# EAGLE design WFT0420CZ15_conv (EAGLE 7.5.0)
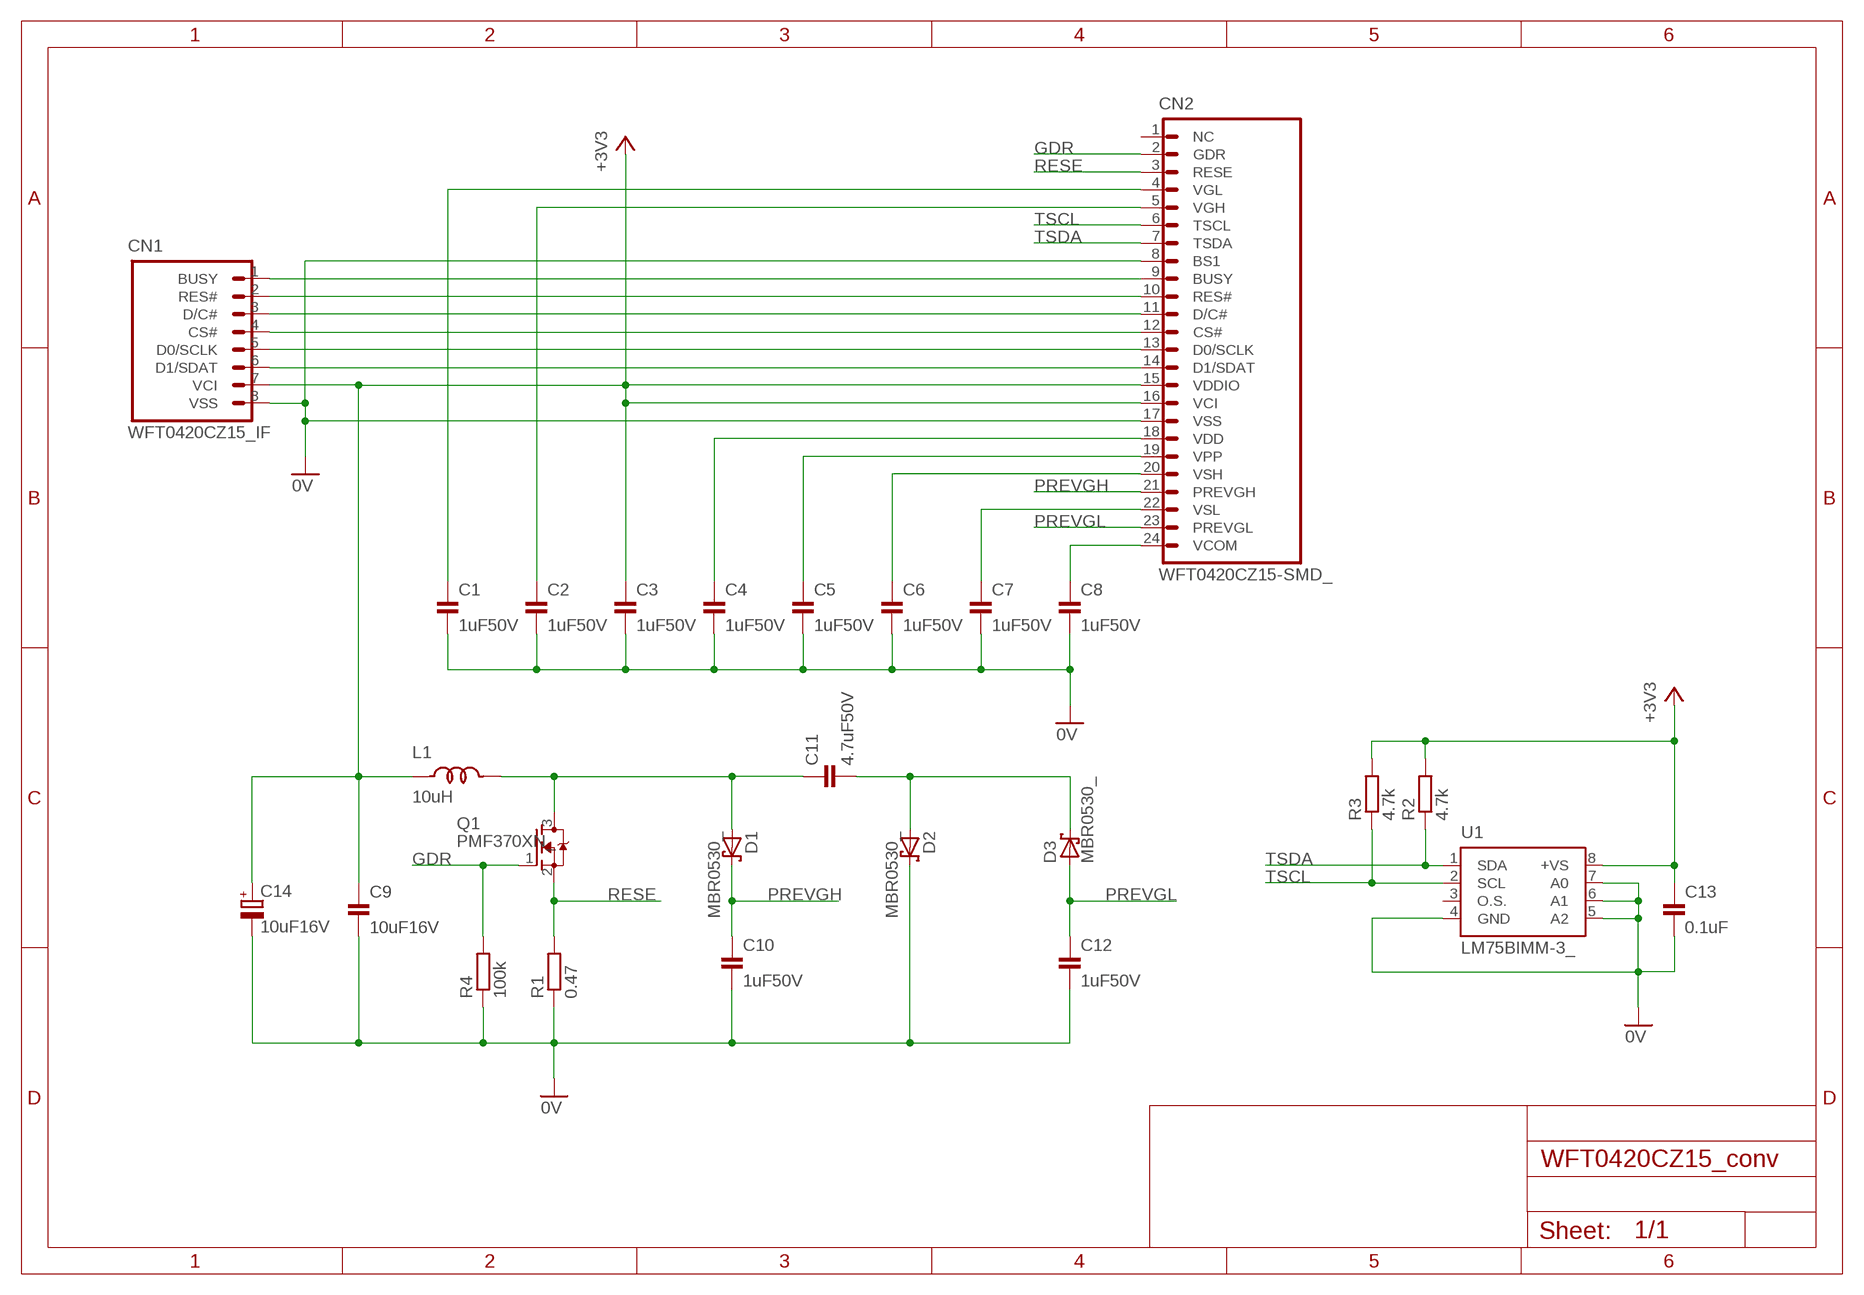
[diagram p0: schematic, sheet 1]

## Parts
C1  1uF50V  CAP_0805  [SMD_2012]
C2  1uF50V  CAP_0805  [SMD_2012]
C3  1uF50V  CAP_0805  [SMD_2012]
C4  1uF50V  CAP_0805  [SMD_2012]
C5  1uF50V  CAP_0805  [SMD_2012]
C6  1uF50V  CAP_0805  [SMD_2012]
C7  1uF50V  CAP_0805  [SMD_2012]
C8  1uF50V  CAP_0805  [SMD_2012]
C9  10uF16V  CAP_0805  [SMD_2012]
C10  1uF50V  CAP_0805  [SMD_2012]
C11  4.7uF50V  CAP_0805  [SMD_2012]
C12  1uF50V  CAP_0805  [SMD_2012]
C13  0.1uF  CAP_0805  [SMD_2012]
C14  10uF16V  TPST106K016R0800  [C1210_TPST]
CN1  WFT0420CZ15_IF  [WFT0420CZ15_IF_8PIN]
CN2  WFT0420CZ15-SMD_  [FH12A-24S-0.5SH_DEV]
D1  MBR0530_  [MBR0530_DEV]
D2  MBR0530_  [MBR0530_DEV]
D3  MBR0530_  [MBR0530_DEV]
L1  10uH  NLCV25T  [NLCV25T]
Q1  PMF370XN_  [SOT323_DEV]
R1  0.47  RESISTOR_0805  [SMD_2012]
R2  4.7k  RESISTOR_0805  [SMD_2012]
R3  4.7k  RESISTOR_0805  [SMD_2012]
R4  100k  RESISTOR_0805  [SMD_2012]
U1  LM75BIMM-3_  [SSOP8-DGK_DEV]

## Nets
0V: C1.2 C2.2 C3.2 C4.2 C5.2 C6.2 C7.2 C8.2 C9.2 C10.2 C12.2 C13.2 C14.2(-) CN1.8(VSS) CN2.8(BS1) CN2.17(VSS) D2.1(C) R1.1 R4.1 U1.4(GND) U1.5(A2) U1.6(A1) U1.7(A0)
+3V3: C3.1 C9.1 C13.1 C14.1(+) CN1.7(VCI) CN2.15(VDDIO) CN2.16(VCI) L1.1 R2.2 R3.2 U1.8(+VS)
GDR: CN2.2(GDR) Q1.1(G) R4.2
N$1: C8.1 CN2.24(VCOM)
N$2: C7.1 CN2.22(VSL)
N$3: C6.1 CN2.20(VSH)
N$4: C5.1 CN2.19(VPP)
N$5: C4.1 CN2.18(VDD)
N$6: C11.1 D1.2(A) L1.2 Q1.3(D)
N$7: C2.1 CN2.5(VGH)
N$8: C1.1 CN2.4(VGL)
N$9: CN1.1(BUSY) CN2.9(BUSY)
N$10: CN1.2(RES#) CN2.10(RES#)
N$11: CN1.3(D/C#) CN2.11(D/C#)
N$12: CN1.4(CS#) CN2.12(CS#)
N$13: CN1.5(D0/SCLK) CN2.13(D0/SCLK)
N$14: CN1.6(D1/SDAT) CN2.14(D1/SDAT)
N$15: C11.2 D2.2(A) D3.1(C)
PREVGH: C10.1 CN2.21(PREVGH) D1.1(C)
PREVGL: C12.1 CN2.23(PREVGL) D3.2(A)
RESE: CN2.3(RESE) Q1.2(S) R1.2
TSCL: CN2.6(TSCL) R3.1 U1.2(SCL)
TSDA: CN2.7(TSDA) R2.1 U1.1(SDA)
Unconnected: CN2.1(NC) U1.3(O.S.)

## Library data of the parts
C1-C13 = Parts:CAP: コンデンサー
C14 = Parts:TPST*: タンタルコンデンサ TPST106K016R0800 10µF ±10% 16V ESR（等価直列抵抗）: 0.8オーム 動作温度 : -55°C～125°C サイズ : 3.50mm x 2.80mm
CN1 = PartsForProto:WFT0420CZ15_IF: WF0420CZ15変換基板用I/F
CN2 = PartsForProto:WFT0420CZ15: インターフェースピン
D1-D3 = Parts:MBR0530: ショットキーダイオード
L1 = Parts:NLCV*: LEAD INDUCTOR
Q1 = Parts:PMF370XN: N-Channel 30 V (D-S) MOSFET
R1-R4 = Parts:RESISTOR: 抵抗器
U1 = Parts:LM75B*: 基板取付型温度センサー

## Board
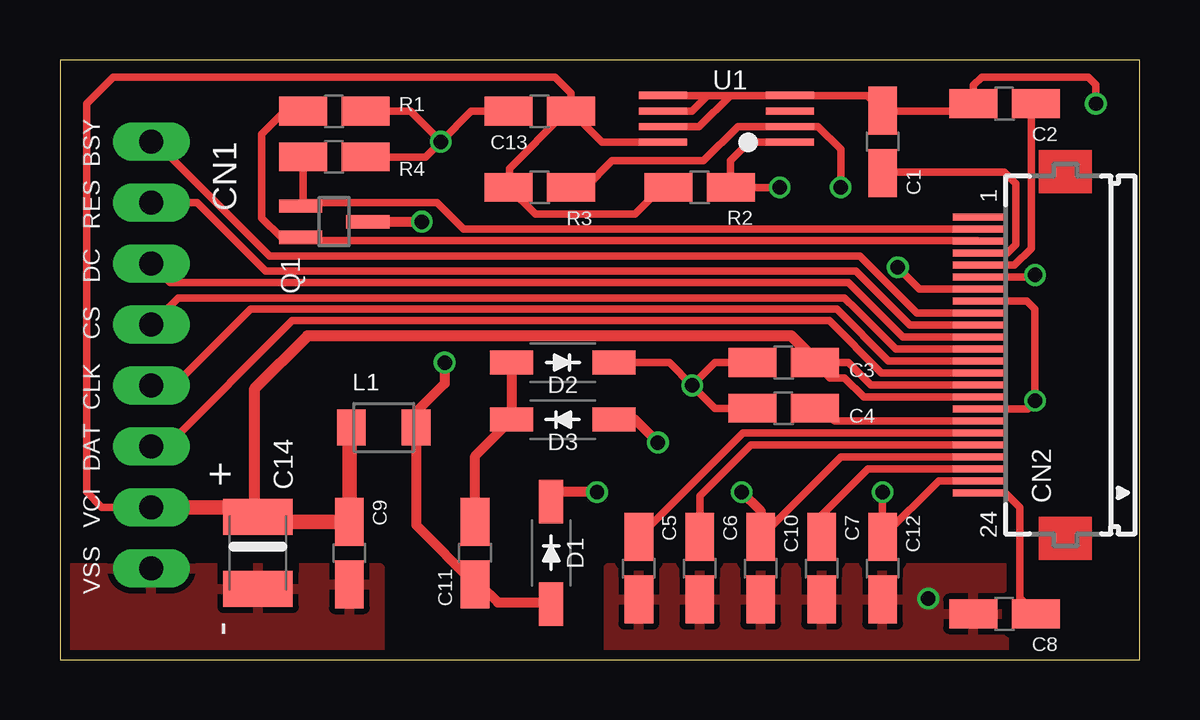
[diagram p1: board, top side]
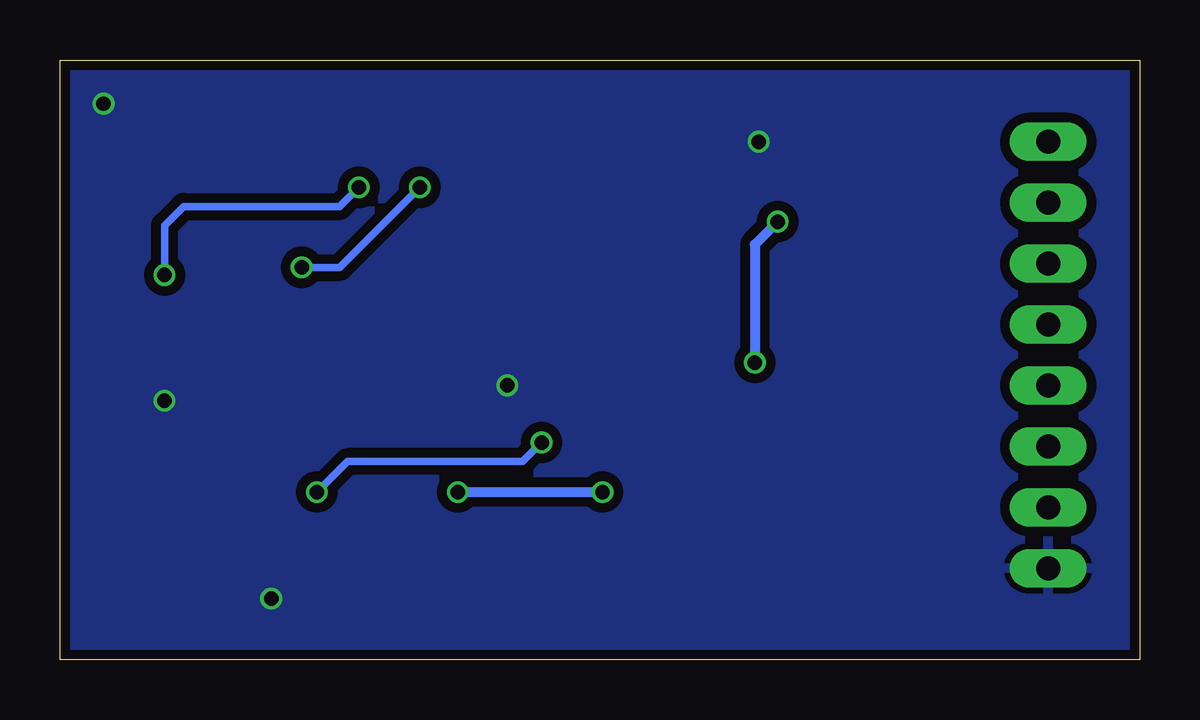
[diagram p2: board, bottom side, seen from below]

Size 45 x 25 mm. Coordinates in mm from the lower left corner, seen from the top.
Outline: 0,0 45,0 45,25 0,25 0,0
Copper layers (1*16): Top 0.035mm / dielectric 1.5mm / Bottom 0.035mm
Design rules "SeeedStudio_2layer_DRU_no_angle_20140221": minimum track width 6mil, minimum drill 12mil, track to track 6mil, track to pad 6mil, pad to pad 6mil, via to via 6mil, smd to smd 0mil, copper to edge 10mil, drill to drill 10mil, minimum pad ring 10mil, minimum via ring 6mil, stop-mask expansion 2mil, vias tented up to drill 100mil, thermal gap 10mil

### Footprints (pad centres in the part's own frame; a part is rotated, then mirrored left to right if it is on the bottom)
SMD_2012 = smd 2 x 1.2: 1 -1.3,0; 2 1.3,0
C1210_TPST = smd 1.5 x 2.9: 1 -1.5,0; 2 1.5,0
WFT0420CZ15_IF_8PIN = drill 1 pad 1.6 long: 1 0,0; 2 2.54,0; 3 5.08,0; 4 7.62,0; 5 10.16,0; 6 12.7,0; 7 15.24,0; 8 17.78,0
FH12A-24S-0.5SH_DEV = smd 0.3 x 2.1: 1 5.75,3.65; 2 5.25,3.65; 3 4.75,3.65; 4 4.25,3.65; 5 3.75,3.65; 6 3.25,3.65; 7 2.75,3.65; 8 2.25,3.65; 9 1.75,3.65; 10 1.25,3.65; 11 0.75,3.65; 12 0.25,3.65; 13 -0.25,3.65; 14 -0.75,3.65; 15 -1.25,3.65; 16 -1.75,3.65; 17 -2.25,3.65; 18 -2.75,3.65; 19 -3.25,3.65; 20 -3.75,3.65; 21 -4.25,3.65; 22 -4.75,3.65; 23 -5.25,3.65; 24 -5.75,3.65
MBR0530_DEV = smd 1.8 x 1: 1 -2.135,0; 2 2.135,0
NLCV25T = smd 1.2 x 1.5: 1 -1.35,0; 2 1.35,0
SOT323_DEV = smd 0.56 x 1.8: 1 -0.65,-1.4; 2 0.65,-1.4; 3 0,1.4
SSOP8-DGK_DEV = smd 0.3 x 2: 1 -0.975,-2.65; 2 -0.325,-2.65; 3 0.325,-2.65; 4 0.975,-2.65; 5 0.975,2.65; 6 0.325,2.65; 7 -0.325,2.65; 8 -0.975,2.65

### Placement (x,y rotation side)
C1  34.29,21.59 90 top
C2  39.37,23.18 180 top
C3  30.16,12.38 180 top
C4  30.16,10.48 180 top
C5  24.13,3.81 270 top
C6  26.67,3.81 270 top
C7  31.75,3.81 270 top
C8  39.37,1.91 180 top
C9  12.06,4.45 270 top
C10  29.21,3.81 270 top
C11  17.3,4.45 90 top
C12  34.29,3.81 270 top
C13  20,22.86 180 top
C14  8.26,4.45 270 top
CN1  3.81,21.59 270 top
CN2  41.91,12.7 90 top
D1  20.48,4.45 270 top
D2  20.95,12.38 180 top
D3  20.95,10 0 top
L1  13.49,9.68 0 top
Q1  11.43,18.26 270 top
R1  11.43,22.86 180 top
R2  26.67,19.68 180 top
R3  20,19.68 180 top
R4  11.43,20.95 180 top
U1  27.78,22.54 90 top

### Tracks (layer width: path | path; a pad name or v marks a point on that pad's centre or on a via)
0V  (via drill 0.6)
  Top 0.305: CN2.17 40.35,10.45 v40.64,10.79 40.64,14.61 40.3,14.95 CN2.8 | C3.2 27.3,12.38 v26.35,11.43 | C4.2 27.3,10.48 v26.35,11.43 | D2.1 25.4,12.38 v26.35,11.43 | 13.34,22.86 R1.1 14.61,22.86 v15.88,21.59 | C13.2 17.14,22.86 v15.88,21.59 | U1.5 26.99,23.52 | 26.99,23.52 27.94,23.52 | 27.94,23.52 U1.4 33.66,23.52 C1.2 34.32,22.86 37.78,22.86 38.07,23.15 C2.2 38.07,23.94 38.42,24.29 42.86,24.29 43.18,23.97 v43.18,23.18 | U1.6 26.34,22.87 26.99,23.52 | U1.7 26.64,22.22 27.94,23.52 | R4.1 15.24,20.95 v15.88,21.59
  other vias: 36.2,2.54
  pour Bottom (isolate 0.406): -1.27,26.04 46.35,26.04 46.35,-0.79 -1.27,-0.79
  pour Top (isolate 0.406): 22.86,-0.64 39.37,-0.64 39.37,3.81 22.86,3.81
  pour Top (isolate 0.406): -0.64,-0.64 13.34,-0.64 13.34,3.81 -0.64,3.81
+3V3
  Top 0.305: CN2.16 33.5,10.95 32.7,11.75 32.1,11.75 C3.1 | C13.1 21.3,23.62 20.64,24.29 2.22,24.29 1.11,23.18 1.11,6.99 1.75,6.35 CN1.7 | 8.46,5.75 C14.1 | C14.1 7.39,5.95 6.99,6.35 | U1.8 22.59,21.57 C13.1 | C3.1 31.43,12.38 | 8.41,6.1 C14.1 | CN2.15 33.79,11.45 32.86,12.38 C3.1 | C13.1 21.3,22.73 20.98,22.73 18.73,20.48 18.73,19.71 R3.2 19.81,18.57 23.97,18.57 25.08,19.68 R2.2
  Top 0.406: 32.23,12.38 C3.1
  Top 0.457: C3.1 31.46,12.51 30.48,13.49 10.32,13.49 8.1,11.27 8.1,6.1 C14.1
  Top 0.61: 8.46,5.75 C9.1 12.06,9.61 L1.1 | 6.99,6.35 CN1.7
GDR
  Top 0.305: CN2.2 16.83,17.94 15.72,19.05 10.17,19.05 Q1.1 10.13,19.01 R4.2
N$1
  Top 0.305: CN2.24 39.41,6.95 40.01,6.35 40.01,2.57 C8.1
N$2
  Top 0.305: CN2.22 33.67,7.95 31.75,6.03 C7.1
N$3
  Top 0.305: CN2.20 28.79,8.95 26.67,6.83 C6.1
N$4
  Top 0.305: CN2.19 28.47,9.45 C5.1
N$5
  Top 0.305: CN2.18 32.31,9.95 C4.1
N$6  (via drill 0.6)
  Top 0.406: v16.03,12.38 16.03,11.51 14.84,10.32 L1.2 14.84,5.61 C11.1 17.49,3.15 18.26,2.38 20.41,2.38 D1.2 | Q1.3 v15.08,18.26
  Bottom 0.406: v16.03,12.38 16.03,17.3 v15.08,18.26
N$7
  Top 0.305: CN2.5 39.79,16.45 40.48,17.14 40.48,22.99 C2.1
N$8
  Top 0.305: CN2.4 39.49,16.95 39.85,17.3 39.85,19.84 39.37,20.32 34.32,20.32 C1.1
N$9
  Top 0.305: CN2.9 35.72,14.45 33.34,16.83 8.73,16.83 3.97,21.59 CN1.1
N$10
  Top 0.305: CN2.10 35.42,13.95 33.18,16.19 8.57,16.19 5.71,19.05 CN1.2
N$11
  Top 0.305: CN2.11 35.13,13.45 32.86,15.72 4.6,15.72 CN1.3
N$12
  Top 0.305: CN2.12 34.83,12.95 33.26,14.53 33.18,14.61 32.7,15.08 4.92,15.08 CN1.4
N$13
  Top 0.305: CN2.13 34.54,12.45 32.38,14.61 7.94,14.61 4.76,11.43 CN1.5
N$14
  Top 0.305: CN2.14 34.25,11.95 32.07,14.13 9.68,14.13 4.45,8.89 CN1.6
N$15
  Top 0.406: D2.2 D3.1 17.3,8.48 C11.2
PREVGH  (via drill 0.6)
  Top 0.305: CN2.21 32.55,8.45 C10.1
  Top 0.406: C10.1 29.21,6.19 v28.42,6.99 | v22.38,6.99 20.88,6.99 D1.1
  Bottom 0.406: v28.42,6.99 v22.38,6.99
PREVGL  (via drill 0.6)
  Top 0.305: 34.32,5.08 C12.1 | C12.1 v34.29,6.99 | CN2.23 36.63,7.45 C12.1
  Top 0.406: D3.2 23.97,10 v24.92,9.05
  Bottom 0.305: v24.92,9.05 25.72,8.26 33.02,8.26 v34.29,6.99
RESE
  Top 0.305: CN2.3 38.25,17.46 10.17,17.46 Q1.2 9.22,17.61 8.41,18.41 8.41,21.91 9.37,22.86 R1.2
TSCL  (via drill 0.6)
  Top 0.305: R3.1 21.91,19.68 23.02,20.8 26.83,20.8 28.26,22.23 U1.2 31.59,22.23 32.54,21.27 v32.54,19.68 | CN2.6 40.56,15.95 v40.64,16.03
  Bottom 0.305: v40.64,16.03 40.64,18.1 39.85,18.89 33.34,18.89 v32.54,19.68
TSDA  (via drill 0.6)
  Top 0.305: CN2.7 35.83,15.45 v34.92,16.35 | v30,19.68 R2.1 27.94,19.71 27.94,20.8 28.71,21.57 U1.1
  Bottom 0.305: v34.92,16.35 33.34,16.35 v30,19.68